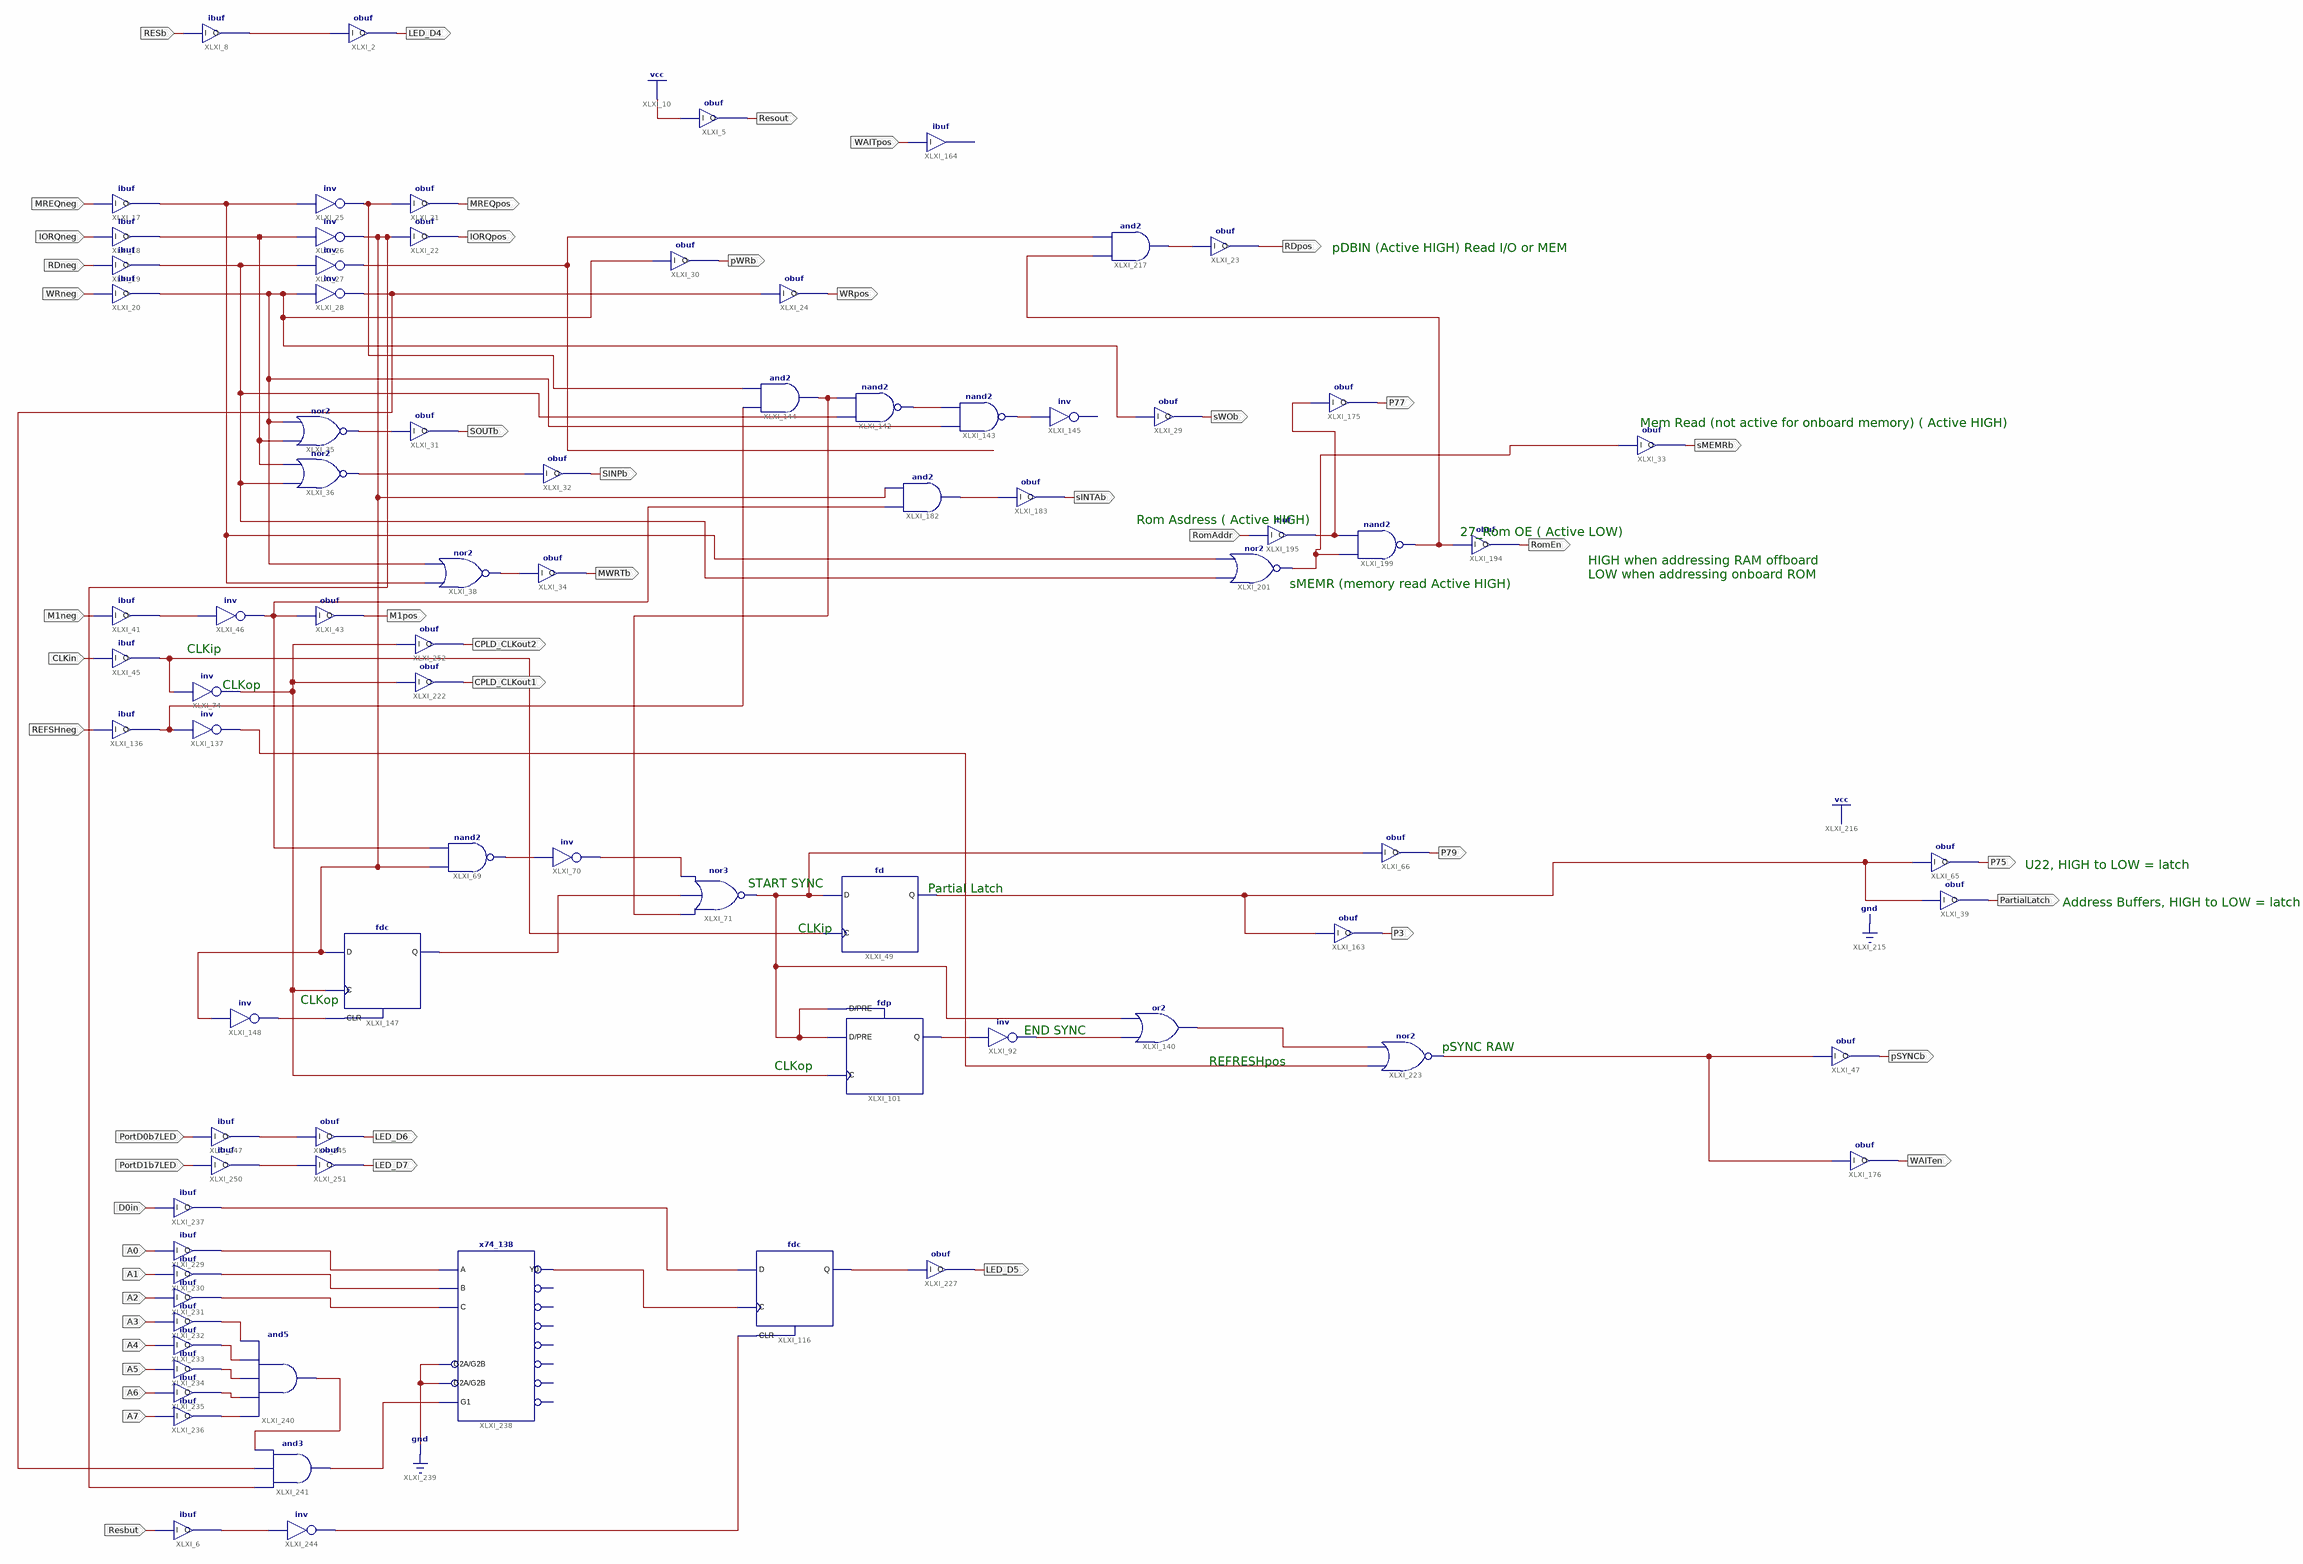
[diagram p0: schematic sheet 1]
// Xilinx ISE schematic IC1v2_7.sch (xc9500) as structural Verilog: 82 symbols, 49 ports
module IC1v2_7 (
  input  RESb,
  input  MREQneg,
  input  IORQneg,
  input  RDneg,
  input  WRneg,
  input  M1neg,
  input  CLKin,
  input  REFSHneg,
  input  WAITpos,
  input  RomAddr,
  input  A0,
  input  A1,
  input  A2,
  input  A3,
  input  A4,
  input  A5,
  input  A6,
  input  A7,
  input  D0in,
  input  Resbut,
  input  PortD0b7LED,
  input  PortD1b7LED,
  output LED_D4,
  output MREQpos,
  output IORQpos,
  output SOUTb,
  output MWRTb,
  output M1pos,
  output sWOb,
  output pSYNCb,
  output pWRb,
  output WRpos,
  output WAITen,
  output sINTAb,
  output RomEn,
  output sMEMRb,
  output RDpos,
  output SINPb,
  output P77,
  output P75,
  output PartialLatch,
  output CPLD_CLKout1,
  output P3,
  output P79,
  output LED_D5,
  output Resout,
  output LED_D6,
  output LED_D7,
  output CPLD_CLKout2
);

  wire XLXN_10, XLXN_40, XLXN_44, XLXN_54, XLXN_58, XLXN_67, XLXN_75, XLXN_129, XLXN_134, XLXN_157, XLXN_164,
       XLXN_169, XLXN_185, XLXN_226, XLXN_230, XLXN_233, XLXN_234, XLXN_239, XLXN_253, XLXN_269, XLXN_308,
       XLXN_309, XLXN_352, XLXN_356, XLXN_359, XLXN_361, XLXN_362, XLXN_367, XLXN_377, XLXN_379, XLXN_385,
       XLXN_389, XLXN_403, XLXN_404, XLXN_405, XLXN_406, XLXN_407, XLXN_408, XLXN_409, XLXN_410, XLXN_411,
       XLXN_412, XLXN_413, XLXN_414, XLXN_416, XLXN_418, XLXN_419, XLXN_420, XLXN_421, XLXN_422, XLXN_430,
       XLXN_431, XLXN_433;

  obuf XLXI_2 (.I(XLXN_10), .O(LED_D4));
  ibuf XLXI_8 (.I(RESb), .O(XLXN_10));
  ibuf XLXI_17 (.I(MREQneg), .O(XLXN_58));
  ibuf XLXI_18 (.I(IORQneg), .O(XLXN_54));
  ibuf XLXI_19 (.I(RDneg), .O(XLXN_385));
  ibuf XLXI_20 (.I(WRneg), .O(XLXN_40));
  obuf XLXI_21 (.I(XLXN_75), .O(MREQpos));
  obuf XLXI_22 (.I(XLXN_413), .O(IORQpos));
  not XLXI_25 (XLXN_75, XLXN_58);
  not XLXI_26 (XLXN_413, XLXN_54);
  not XLXI_27 (XLXN_352, XLXN_385);
  not XLXI_28 (XLXN_412, XLXN_40);
  obuf XLXI_31 (.I(XLXN_309), .O(SOUTb));
  obuf XLXI_34 (.I(XLXN_44), .O(MWRTb));
  nor XLXI_35 (XLXN_309, XLXN_54, XLXN_40);
  nor XLXI_36 (XLXN_361, XLXN_385, XLXN_54);
  ibuf XLXI_41 (.I(M1neg), .O(XLXN_362));
  obuf XLXI_43 (.I(XLXN_67), .O(M1pos));
  ibuf XLXI_45 (.I(CLKin), .O(XLXN_377));
  not XLXI_46 (XLXN_67, XLXN_362);
  fd XLXI_49 (.C(XLXN_377), .D(XLXN_164), .Q(XLXN_389));
  nand XLXI_69 (XLXN_185, XLXN_413, XLXN_67);
  not XLXI_70 (XLXN_129, XLXN_185);
  nor XLXI_71 (XLXN_164, XLXN_253, XLXN_134, XLXN_129);
  not XLXI_74 (XLXN_433, XLXN_377);
  not XLXI_92 (XLXN_169, XLXN_157);
  fdp XLXI_101 (.C(XLXN_433), .D(XLXN_164), .PRE(XLXN_164), .Q(XLXN_157));
  fdc XLXI_116 (.C(XLXN_421), .CLR(XLXN_420), .D(XLXN_422), .Q(XLXN_418));
  ibuf XLXI_136 (.I(REFSHneg), .O(XLXN_226));
  not XLXI_137 (XLXN_230, XLXN_226);
  or XLXI_140 (XLXN_269, XLXN_169, XLXN_164);
  nand XLXI_142 (XLXN_234, XLXN_385, XLXN_253);
  nand XLXI_143 (XLXN_233, XLXN_40, XLXN_234);
  and XLXI_144 (XLXN_253, XLXN_226, XLXN_75);
  // inv XLXI_145 has open pins: I=XLXN_233, O=open
  obuf XLXI_29 (.I(XLXN_40), .O(sWOb));
  fdc XLXI_147 (.C(XLXN_433), .CLR(XLXN_239), .D(XLXN_413), .Q(XLXN_134));
  not XLXI_148 (XLXN_239, XLXN_413);
  obuf XLXI_47 (.I(XLXN_379), .O(pSYNCb));
  ibuf XLXI_164 (.I(WAITpos));  // open: O
  obuf XLXI_30 (.I(XLXN_40), .O(pWRb));
  obuf XLXI_24 (.I(XLXN_412), .O(WRpos));
  obuf XLXI_176 (.I(XLXN_379), .O(WAITen));
  and XLXI_182 (XLXN_308, XLXN_67, XLXN_413);
  obuf XLXI_183 (.I(XLXN_308), .O(sINTAb));
  nor XLXI_38 (XLXN_44, XLXN_58, XLXN_40);
  ibuf XLXI_195 (.I(RomAddr), .O(XLXN_416));
  nand XLXI_199 (XLXN_356, XLXN_359, XLXN_416);
  obuf XLXI_194 (.I(XLXN_356), .O(RomEn));
  nor XLXI_201 (XLXN_359, XLXN_385, XLXN_58);
  obuf XLXI_33 (.I(XLXN_359), .O(sMEMRb));
  obuf XLXI_23 (.I(XLXN_367), .O(RDpos));
  obuf XLXI_32 (.I(XLXN_361), .O(SINPb));
  obuf XLXI_175 (.I(XLXN_416), .O(P77));
  and XLXI_217 (XLXN_367, XLXN_356, XLXN_352);
  obuf XLXI_65 (.I(XLXN_389), .O(P75));
  obuf XLXI_39 (.I(XLXN_389), .O(PartialLatch));
  obuf XLXI_222 (.I(XLXN_433), .O(CPLD_CLKout1));
  nor XLXI_223 (XLXN_379, XLXN_230, XLXN_269);
  obuf XLXI_163 (.I(XLXN_389), .O(P3));
  obuf XLXI_66 (.I(XLXN_164), .O(P79));
  ibuf XLXI_229 (.I(A0), .O(XLXN_403));
  ibuf XLXI_230 (.I(A1), .O(XLXN_404));
  ibuf XLXI_231 (.I(A2), .O(XLXN_405));
  ibuf XLXI_232 (.I(A3), .O(XLXN_406));
  ibuf XLXI_233 (.I(A4), .O(XLXN_407));
  ibuf XLXI_234 (.I(A5), .O(XLXN_408));
  ibuf XLXI_235 (.I(A6), .O(XLXN_409));
  ibuf XLXI_236 (.I(A7), .O(XLXN_410));
  ibuf XLXI_237 (.I(D0in), .O(XLXN_422));
  x74_138 XLXI_238 (
    .A(XLXN_403), .B(XLXN_404), .C(XLXN_405), .G1(XLXN_414), .G2A(1'b0), .G2B(1'b0), .Y0(XLXN_421));  // open: Y1, Y2, Y3, Y4, Y5, Y6, Y7
  and XLXI_240 (XLXN_411, XLXN_410, XLXN_409, XLXN_408, XLXN_407, XLXN_406);
  and XLXI_241 (XLXN_414, XLXN_413, XLXN_412, XLXN_411);
  ibuf XLXI_6 (.I(Resbut), .O(XLXN_419));
  obuf XLXI_227 (.I(XLXN_418), .O(LED_D5));
  not XLXI_244 (XLXN_420, XLXN_419);
  obuf XLXI_5 (.I(1'b1), .O(Resout));
  ibuf XLXI_247 (.I(PortD0b7LED), .O(XLXN_430));
  obuf XLXI_245 (.I(XLXN_430), .O(LED_D6));
  ibuf XLXI_250 (.I(PortD1b7LED), .O(XLXN_431));
  obuf XLXI_251 (.I(XLXN_431), .O(LED_D7));
  obuf XLXI_252 (.I(XLXN_433), .O(CPLD_CLKout2));

  // Notes on the sheet:
  //   pDBIN (Active HIGH) Read I/O or MEM
  //   Mem Read (not active for onboard memory) ( Active HIGH)
  //   Rom Asdress ( Active HIGH)
  //   27_Rom OE ( Active LOW)
  //   HIGH when addressing RAM offboard
  //   LOW when addressing onboard ROM
  //   sMEMR (memory read Active HIGH)
  //   CLKip
  //   CLKop
  //   U22, HIGH to LOW = latch
  //   START SYNC
  //   Partial Latch
  //   Address Buffers, HIGH to LOW = latch
  //   CLKip
  //   CLKop
  //   END SYNC
  //   pSYNC RAW
  //   REFRESHpos
  //   CLKop
endmodule
